# Altium schematic sheet Memory.SchDoc
size A4
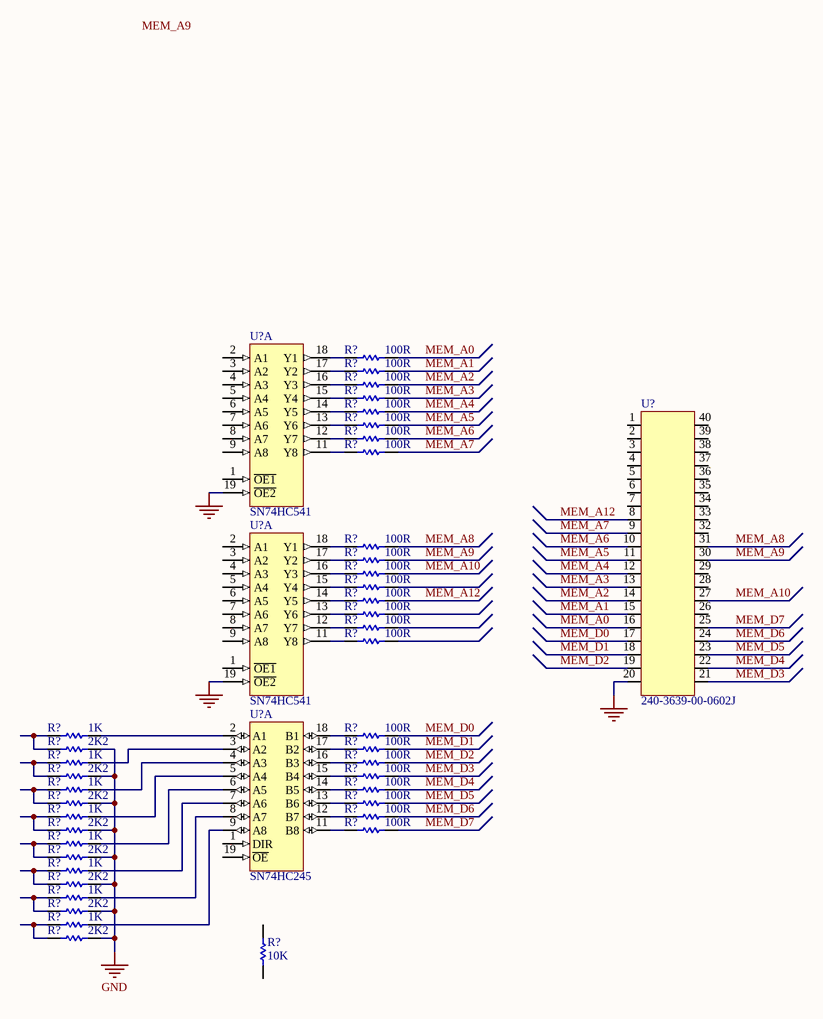
[diagram p0: Memory.SchDoc]

## Parts
(Parts that share a designator on the sheet are numbered #1, #2 ... from top to bottom, then left to right.)
R?#1  100R  [0805]
R?#2  100R  [0805]
R?#3  100R  [0805]
R?#4  100R  [0805]
R?#5  100R  [0805]
R?#6  100R  [0805]
R?#7  100R  [0805]
R?#8  100R  [0805]
R?#9  100R  [0805]
R?#10  100R  [0805]
R?#11  100R  [0805]
R?#12  100R  [0805]
R?#13  100R  [0805]
R?#14  100R  [0805]
R?#15  100R  [0805]
R?#16  100R  [0805]
R?#17  1K  [0805]
R?#18  100R  [0805]
R?#19  2K2  [0805]
R?#20  100R  [0805]
R?#21  1K  [0805]
R?#22  100R  [0805]
R?#23  2K2  [0805]
R?#24  100R  [0805]
R?#25  1K  [0805]
R?#26  100R  [0805]
R?#27  2K2  [0805]
R?#28  100R  [0805]
R?#29  1K  [0805]
R?#30  100R  [0805]
R?#31  2K2  [0805]
R?#32  100R  [0805]
R?#33  1K  [0805]
R?#34  2K2  [0805]
R?#35  1K  [0805]
R?#36  2K2  [0805]
R?#37  1K  [0805]
R?#38  2K2  [0805]
R?#39  1K  [0805]
R?#40  2K2  [0805]
R?#41  10K  [0805]
U?#1  SN74HC541  [SOIC20]  (part A of 2)
U?#2  SN74HC541  [SOIC20]  (part A of 2)
U?#3  240-3639-00-0602J  [240-3639-00-0602J]
U?#4  SN74HC245  [SOIC20]  (part A of 2)

## Nets
GND: R?#19.2 R?#23.2 R?#27.2 R?#31.2 R?#34.2 R?#36.2 R?#38.2 R?#40.2 U?#1.19(~{OE2}) U?#2.19(~{OE2}) U?#3.20
MEM_A0: R?#1.2 U?#3.16
MEM_A1: R?#2.2 U?#3.15
MEM_A2: R?#3.2 U?#3.14
MEM_A3: R?#4.2 U?#3.13
MEM_A4: R?#5.2 U?#3.12
MEM_A5: R?#6.2 U?#3.11
MEM_A6: R?#7.2 U?#3.10
MEM_A7: R?#8.2 U?#3.9
MEM_A8: R?#9.2 U?#3.31
MEM_A9: R?#10.2 U?#3.30
MEM_A10: R?#11.2 U?#3.27
MEM_A12: R?#13.2 U?#3.8
MEM_D0: R?#18.2 U?#3.17
MEM_D1: R?#20.2 U?#3.18
MEM_D2: R?#22.2 U?#3.19
MEM_D3: R?#24.2 U?#3.21
MEM_D4: R?#26.2 U?#3.22
MEM_D5: R?#28.2 U?#3.23
MEM_D6: R?#30.2 U?#3.24
MEM_D7: R?#32.2 U?#3.25
NetR?#1_1: R?#1.1 U?#1.18(Y1)
NetR?#2_1: R?#2.1 U?#1.17(Y2)
NetR?#3_1: R?#3.1 U?#1.16(Y3)
NetR?#4_1: R?#4.1 U?#1.15(Y4)
NetR?#5_1: R?#5.1 U?#1.14(Y5)
NetR?#6_1: R?#6.1 U?#1.13(Y6)
NetR?#7_1: R?#7.1 U?#1.12(Y7)
NetR?#8_1: R?#8.1 U?#1.11(Y8)
NetR?#9_1: R?#9.1 U?#2.18(Y1)
NetR?#10_1: R?#10.1 U?#2.17(Y2)
NetR?#11_1: R?#11.1 U?#2.16(Y3)
NetR?#12_1: R?#12.1 U?#2.15(Y4)
NetR?#13_1: R?#13.1 U?#2.14(Y5)
NetR?#14_1: R?#14.1 U?#2.13(Y6)
NetR?#15_1: R?#15.1 U?#2.12(Y7)
NetR?#16_1: R?#16.1 U?#2.11(Y8)
NetR?#17_1: R?#17.1 R?#19.1
NetR?#17_2: R?#17.2 U?#4.2(A1)
NetR?#18_1: R?#18.1 U?#4.18(B1)
NetR?#20_1: R?#20.1 U?#4.17(B2)
NetR?#21_1: R?#21.1 R?#23.1
NetR?#21_2: R?#21.2 U?#4.3(A2)
NetR?#22_1: R?#22.1 U?#4.16(B3)
NetR?#24_1: R?#24.1 U?#4.15(B4)
NetR?#25_1: R?#25.1 R?#27.1
NetR?#25_2: R?#25.2 U?#4.4(A3)
NetR?#26_1: R?#26.1 U?#4.14(B5)
NetR?#28_1: R?#28.1 U?#4.13(B6)
NetR?#29_1: R?#29.1 R?#31.1
NetR?#29_2: R?#29.2 U?#4.5(A4)
NetR?#30_1: R?#30.1 U?#4.12(B7)
NetR?#32_1: R?#32.1 U?#4.11(B8)
NetR?#33_1: R?#33.1 R?#34.1
NetR?#33_2: R?#33.2 U?#4.6(A5)
NetR?#35_1: R?#35.1 R?#36.1
NetR?#35_2: R?#35.2 U?#4.7(A6)
NetR?#37_1: R?#37.1 R?#38.1
NetR?#37_2: R?#37.2 U?#4.8(A7)
NetR?#39_1: R?#39.1 R?#40.1
NetR?#39_2: R?#39.2 U?#4.9(A8)

Not connected (* = marked no-connect by the designer): R?#12 2; R?#14 2; R?#15 2; R?#16 2; R?#41 1 2; U?#1 1(~{OE1}) 2(A1) 3(A2) 4(A3) 5(A4) 6(A5) 7(A6) 8(A7) 9(A8); U?#2 1(~{OE1}) 2(A1) 3(A2) 4(A3) 5(A4) 6(A5) 7(A6) 8(A7) 9(A8); U?#3 1 2 3 4 5 6 7 26 28 29 32 33 34 35 36 37 38 39 40; U?#4 1(DIR) 19(~{OE})

## Notes on the sheet
- Labels drawn without touching a wire or pin: MEM_A9

## Library data of the parts
R?#1-R?#41 = Resistor
U?#1 U?#2 = SN74HC541 Type-2: Octal Buffers and Line Drivers With 3-State Outputs
U?#3 = 240-3639-00-0602J: DIP Sockets - 40 Pins
U?#4 = SN74HC245 Type-2: Octal Bus Transceivers with 3-State Outputs